# Altium schematic sheet KillSwitch.SchDoc
size 420 x 297 mm; SheetNumber: 4; SheetTotal: 4
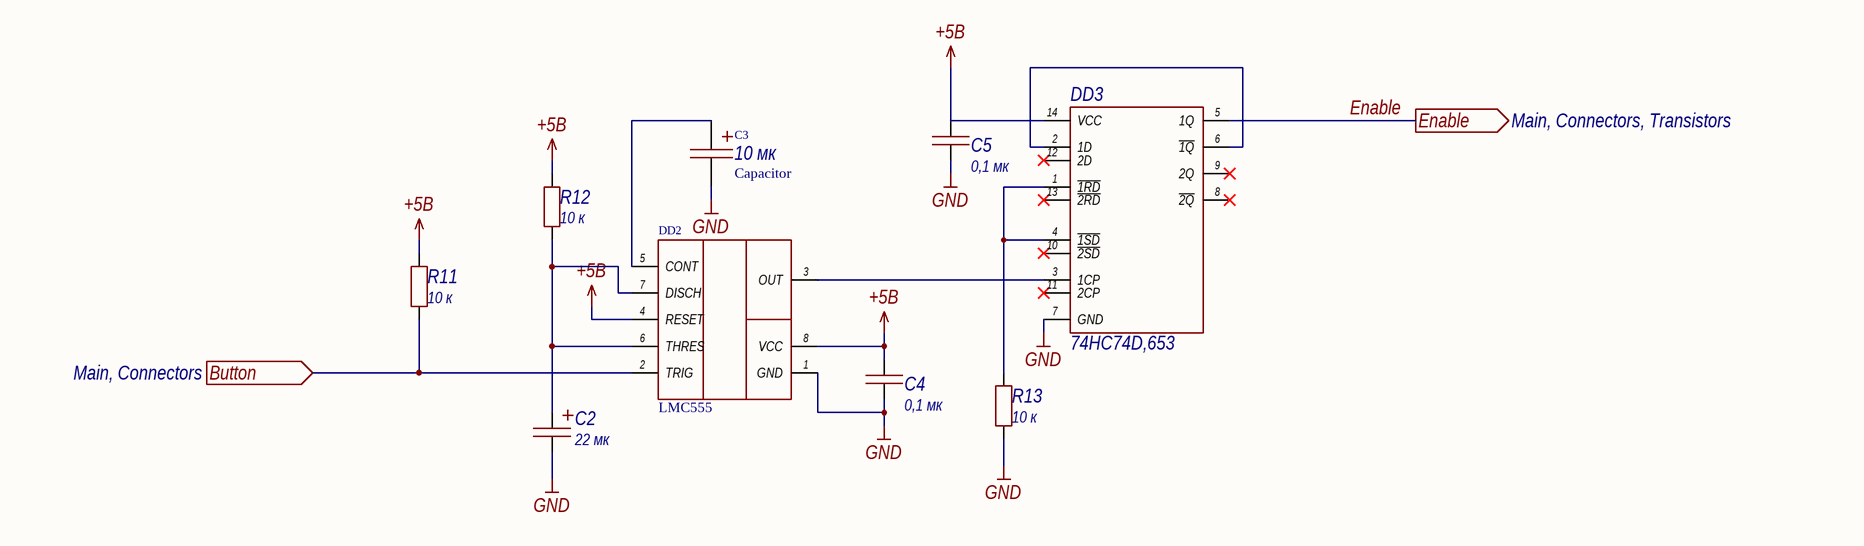
[diagram p0: KillSwitch.SchDoc]

## Parts
C2  value 22 мк  [TC_A]  (hidden comment: Capacitor)
C3  Capacitor  value 10 мк  [TC_A]
C4  value 0,1 мк  [0603C]  (hidden comment: Capacitor)
C5  value 0,1 мк  [0603C]  (hidden comment: Capacitor)
DD2  LMC555  [SOIC-8]
DD3  74HC74D,653  [SOIC-14]
R11  value 10 к  [0603R]  (hidden comment: Resistor)
R12  value 10 к  [0603R]  (hidden comment: Resistor)
R13  value 10 к  [0603R]  (hidden comment: Resistor)

## Ports
Button (in, see Main, Connectors), Enable (out, see Main, Connectors, Transistors)

## Nets
+5В: C4.2 C5.1 DD2.4(RESET) DD2.8(VCC) DD3.14(VCC) R11.2 R12.2
GND: C2.2 C3.2 C4.1 C5.2 DD2.1(GND) DD3.7(GND) R13.1
Button: DD2.2(TRIG) R11.1 ; port Button
Enable: DD3.5(1Q) ; port Enable
NetC2_1: C2.1 DD2.6(THRES) DD2.7(DISCH) R12.1
NetC3_1: C3.1 DD2.5(CONT)
NetDD2_3: DD2.3(OUT) DD3.3(1CP)
NetDD3_1: DD3.1(~{1RD}) DD3.4(~{1SD}) R13.2
NetDD3_2: DD3.2(1D) DD3.6(~{1Q})

Not connected (* = marked no-connect by the designer): DD3 8(~{2Q})* 9(2Q)* 10(~{2SD})* 11(2CP)* 12(2D)* 13(~{2RD})*

## Notes on the sheet
- Перв. примен.
- Справ. №
- Подп. и дата
- Инв. № дубл.
- Взам. инв. №
- Инв. № подл.
- Изм.
- Лист
- № докум.
- Подп.
- Дата
- Копировал
- Формат А3

## Library data of the parts
C2 = Capacitor_22u_10_50V_TC_A: Танталовый конденсатор; Tolerance: 0,1; Voltage (V): 50; Type: Tantalum; Capacity (uF): 22; Part Number: Capacitor_22u_10_50V_TC_A
C3 = Capacitor_10u_10_50V_TC_A: Танталовый конденсатор; Tolerance: 0,1; Voltage (V): 50; Type: Tantalum; Capacity (uF): 10; Part Number: Capacitor_10u_10_50V_TC_A
C4 C5 = Capacitor_0,1u_10_50V_X7R_0603C: Конденсатор; Library Path2: Schematic\Capacitor.SchLib; Tolerance: 0,1; Voltage (V): 50; Dielectric: X7R; Capacity (nF): 100; Part Number: Capacitor_0,1u_10_50V_X7R_0603C
DD2 = LMC555: Таймер интегральный прецизионный КМОП; Part Number: LMC555
DD3 = 74HC74D,653: Два триггера D-типа; MF: Nexperia USA; SnapEDA_Link: https://www.snapeda.com/parts/74HC74D,653/Nexperia/view-part/?ref=snap; Package: SO14-14 Nexperia USA Inc.; Value: *; MP: 74HC74D,653; Check_prices: https://www.snapeda.com/parts/74HC74D,653/Nexperia/view-part/?ref=eda; Part Number: 74HC74D,653
R11-R13 = Resistor_10k_1_0603: Резистор номиналом 10 кОм и точностью 1%; Power: *; Part Number: Resistor_10k_1_0603; Tolerance: 1%